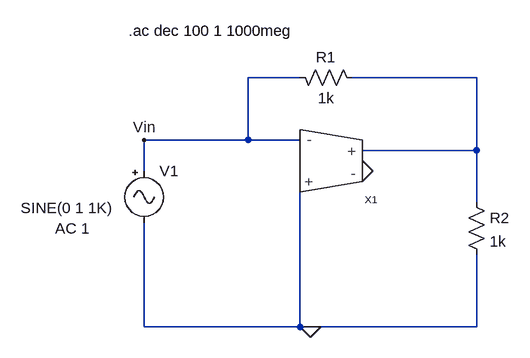
[diagram p0: schematic ejer3d.asc]
ejer3d.asc, the LTspice schematic file:
Version 4
SHEET 1 896 680
WIRE 128 0 48 0
WIRE 400 0 208 0
WIRE 48 96 48 0
WIRE 48 96 -112 96
WIRE 128 96 48 96
WIRE 400 112 400 0
WIRE 400 112 224 112
WIRE -112 144 -112 96
WIRE 400 192 400 112
WIRE -112 384 -112 224
WIRE 128 384 128 160
WIRE 128 384 -112 384
WIRE 144 384 128 384
WIRE 400 384 400 272
WIRE 400 384 144 384
FLAG 224 144 0
FLAG 144 384 0
FLAG -112 96 Vin
SYMBOL OTAdif 208 128 M180
SYMATTR InstName X1
SYMATTR SpiceLine gm=100u
SYMBOL Misc\\signal -112 128 R0
WINDOW 3 -190 73 Left 2
WINDOW 123 -137 104 Left 2
WINDOW 39 0 0 Left 0
SYMATTR Value2 AC 1
SYMATTR InstName V1
SYMBOL res 224 16 M270
WINDOW 0 32 56 VTop 2
WINDOW 3 0 56 VBottom 2
SYMATTR InstName R1
SYMATTR Value 1k
SYMBOL res 384 176 R0
SYMATTR InstName R2
SYMATTR Value 1k
TEXT -136 -72 Left 2 !.ac dec 100 1 1000meg

The netlist it stands for:
* ejer3d.asc
XX1 0 Vin 0 N001 OTAdif params: gm=100u  ; pins V+ V- Io- Io+
V1 Vin 0 SINE(0 1 1K) AC 1
R1 N001 Vin 1k
R2 N001 0 1k
.ac dec 100 1 1000meg
.backanno
.end